# EAGLE design Ana-DigiColorMixerV1 (EAGLE 6.4)
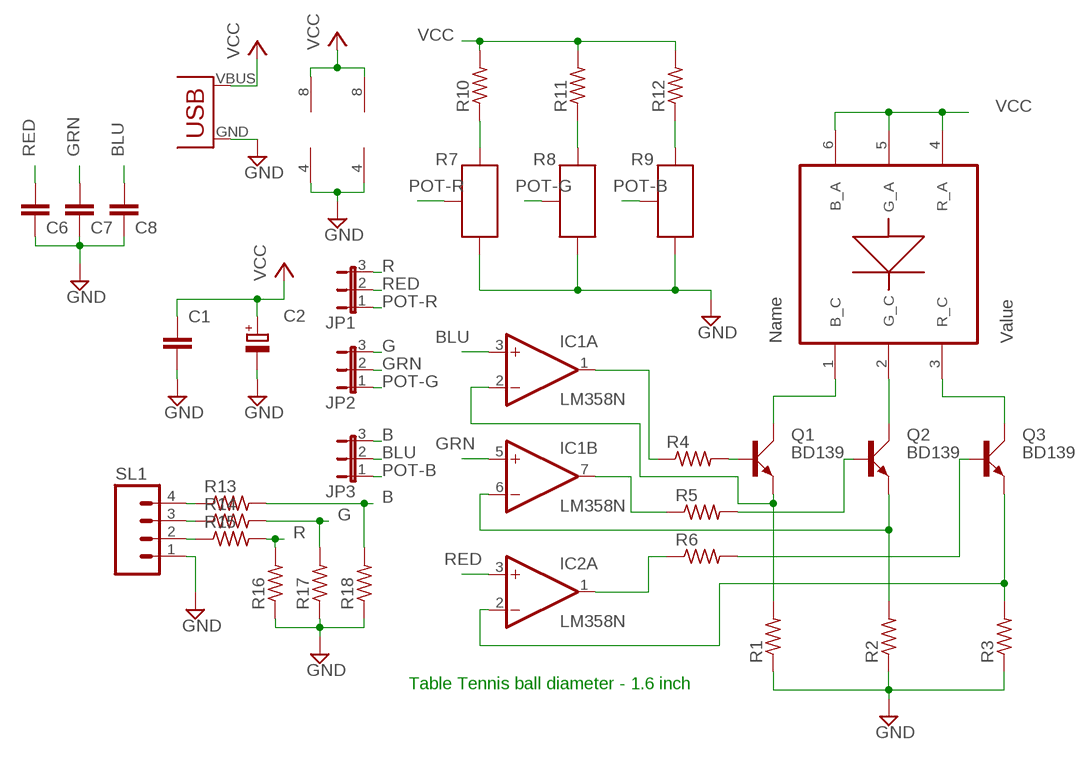
[diagram p0: schematic, sheet 1]

## Parts
C1  0.1uf  C-EU025-024X044  [C025-024X044]
C2  100uf  CPOL-EUE3.5-8  [E3,5-8]
C6  0.1uf  C-EU025-024X044  [C025-024X044]
C7  0.1uf  C-EU025-024X044  [C025-024X044]
C8  0.1uf  C-EU025-024X044  [C025-024X044]
IC1  LM358N  [DIL08]
IC2  LM358N  [DIL08]
JP1  JP2E  [JP2]
JP2  JP2E  [JP2]
JP3  JP2E  [JP2]
Q1  BD139  [TO126AV]
Q2  BD139  [TO126AV]
Q3  BD139  [TO126AV]
R1  4.7  R-US_0411/15  [0411/15]
R2  R-US_0411/15  [0411/15]
R3  R-US_0411/15  [0411/15]
R4  R-US_0204/7  [0204/7]
R5  R-US_0204/7  [0204/7]
R6  R-US_0204/7  [0204/7]
R7  POTNORMAL  [RJ9W]
R8  POTNORMAL  [RJ9W]
R9  POTNORMAL  [RJ9W]
R10  R-US_0204/7  [0204/7]
R11  R-US_0204/7  [0204/7]
R12  R-US_0204/7  [0204/7]
R13  R-US_0204/7  [0204/7]
R14  R-US_0204/7  [0204/7]
R15  R-US_0204/7  [0204/7]
R16  R-US_0204/7  [0204/7]
R17  R-US_0204/7  [0204/7]
R18  R-US_0204/7  [0204/7]
SL1  M04  [04P]
U$1  RGB_SMD_3W  [RGB_SMD_6PIN]
U$2  USB(POWER)  [USB(POWER)]

## Nets
3V3: R9.E R12.1
B: JP3.3 R13.2 R18.2
BLU: C8.1 IC1.3(A:+IN) JP3.2
G: JP2.3 R14.2 R17.2
GND: C1.2 C2.- C6.2 C7.2 C8.2 IC1.4(P:V-) IC2.4(P:V-) R1.1 R2.1 R3.1 R7.A R8.A R9.A R16.1 R17.1 R18.1 SL1.1 U$2.GND
GRN: C7.1 IC1.5(B:+IN) JP2.2
N$1: Q1.C U$1.1(B_C)
N$3: Q2.C U$1.2(G_C)
N$4: Q3.C U$1.3(R_C)
N$5: Q1.B R4.2
N$6: Q2.B R5.2
N$10: Q3.B R6.2
N$12: IC1.6(B:-IN) Q2.E R2.2
N$13: R13.1 SL1.4
N$14: IC1.1(A:OUT) R4.1
N$15: IC1.7(B:OUT) R5.1
N$16: IC2.1(A:OUT) R6.1
N$17: R14.1 SL1.3
N$18: R15.1 SL1.2
N$20: R7.E R10.1
N$21: R8.E R11.1
N$22: IC1.2(A:-IN) Q1.E R1.2
N$24: IC2.2(A:-IN) Q3.E R3.2
POT-B: JP3.1 R9.S
POT-G: JP2.1 R8.S
POT-R: JP1.1 R7.S
R: JP1.3 R15.2 R16.2
RED: C6.1 IC2.3(A:+IN) JP1.2
VCC: C1.1 C2.+ IC1.8(P:V+) IC2.8(P:V+) R10.2 R11.2 R12.2 U$1.4(R_A) U$1.5(G_A) U$1.6(B_A) U$2.VBUS(VCC)
Unconnected: IC2.5(B:+IN) IC2.6(B:-IN) IC2.7(B:OUT)

## Notes on the sheet
- Table Tennis ball diameter - 1.6 inch

## Library data of the parts
C1 C6-C8 = rcl:C-EU: CAPACITOR, European symbol
C2 = rcl:CPOL-EU: POLARIZED CAPACITOR, European symbol
IC1 IC2 = CEDT_JANUARY_2015:LM358: OP AMP also LM158; LM258; LM2904 Source: http://cache.national.com/ds/LM/LM158.pdf
JP1-JP3 = jumper:JP2E: JUMPER
Q1-Q3 = transistor-power:BD139: NPN TRANSISTOR
R1-R6 R10-R18 = resistor:R-US_: RESISTOR, American symbol
R7-R9 = CEDTv78:POT
SL1 = con-amp-quick:M04: AMP QUICK CONNECTOR; OC_FARNELL: unknown; OC_NEWARK: unknown
U$1 = CEDTv78:RGB_SMD_3W: RGB SMD 3W(1W each)
U$2 = CEDT_JANUARY_2015_v5:USB(POWER)

## Net classes
0 default: width 0.61 mm
1 power: width 0.61 mm

## Board
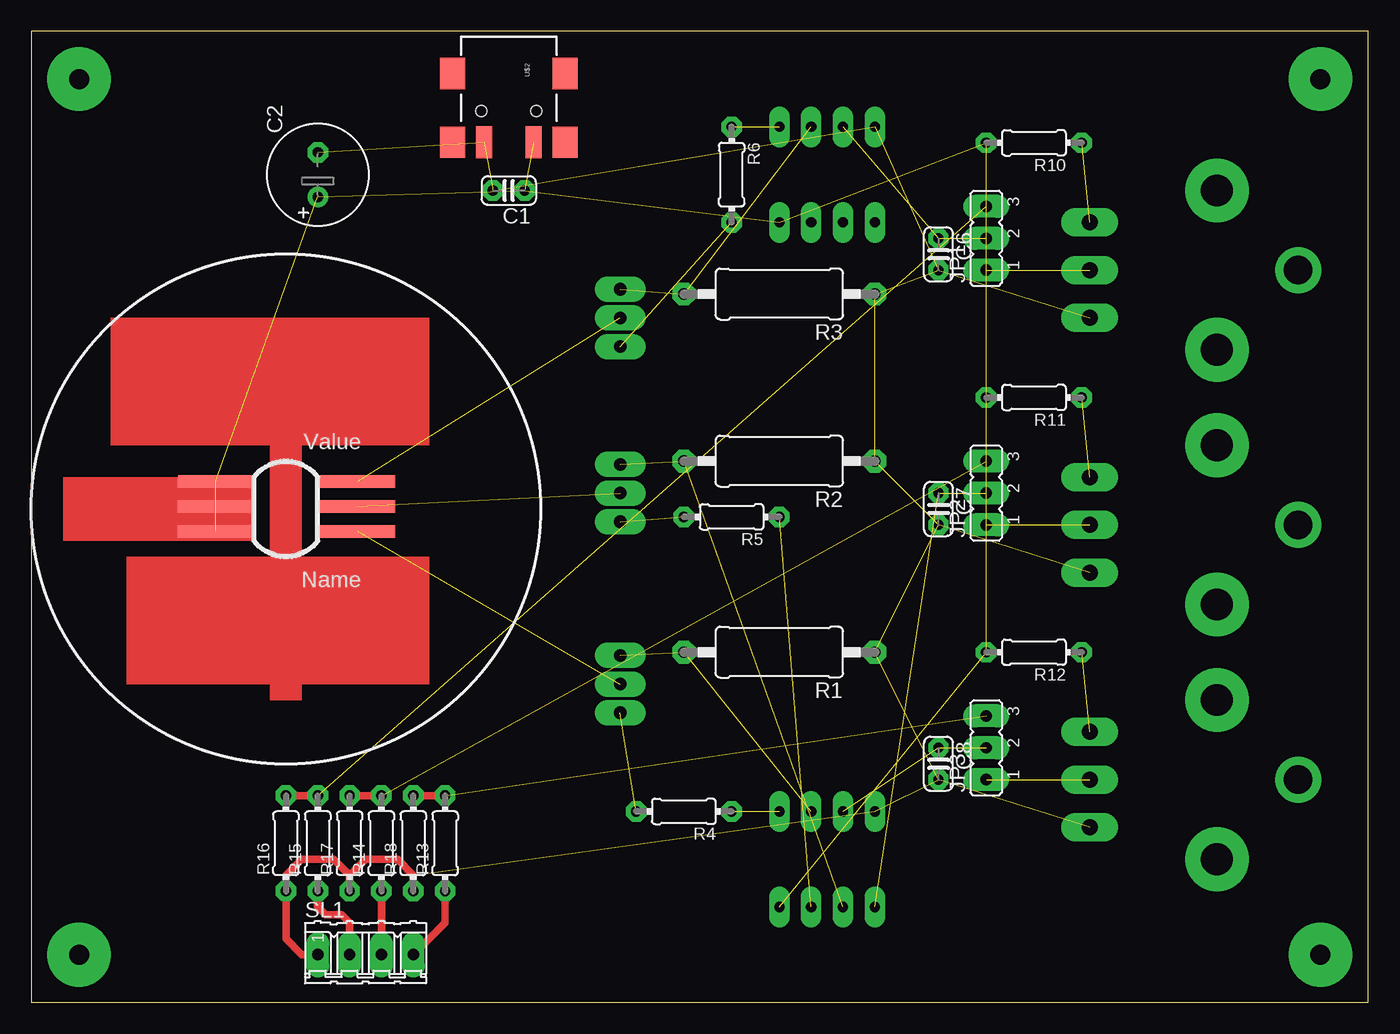
[diagram p1: board, top side]
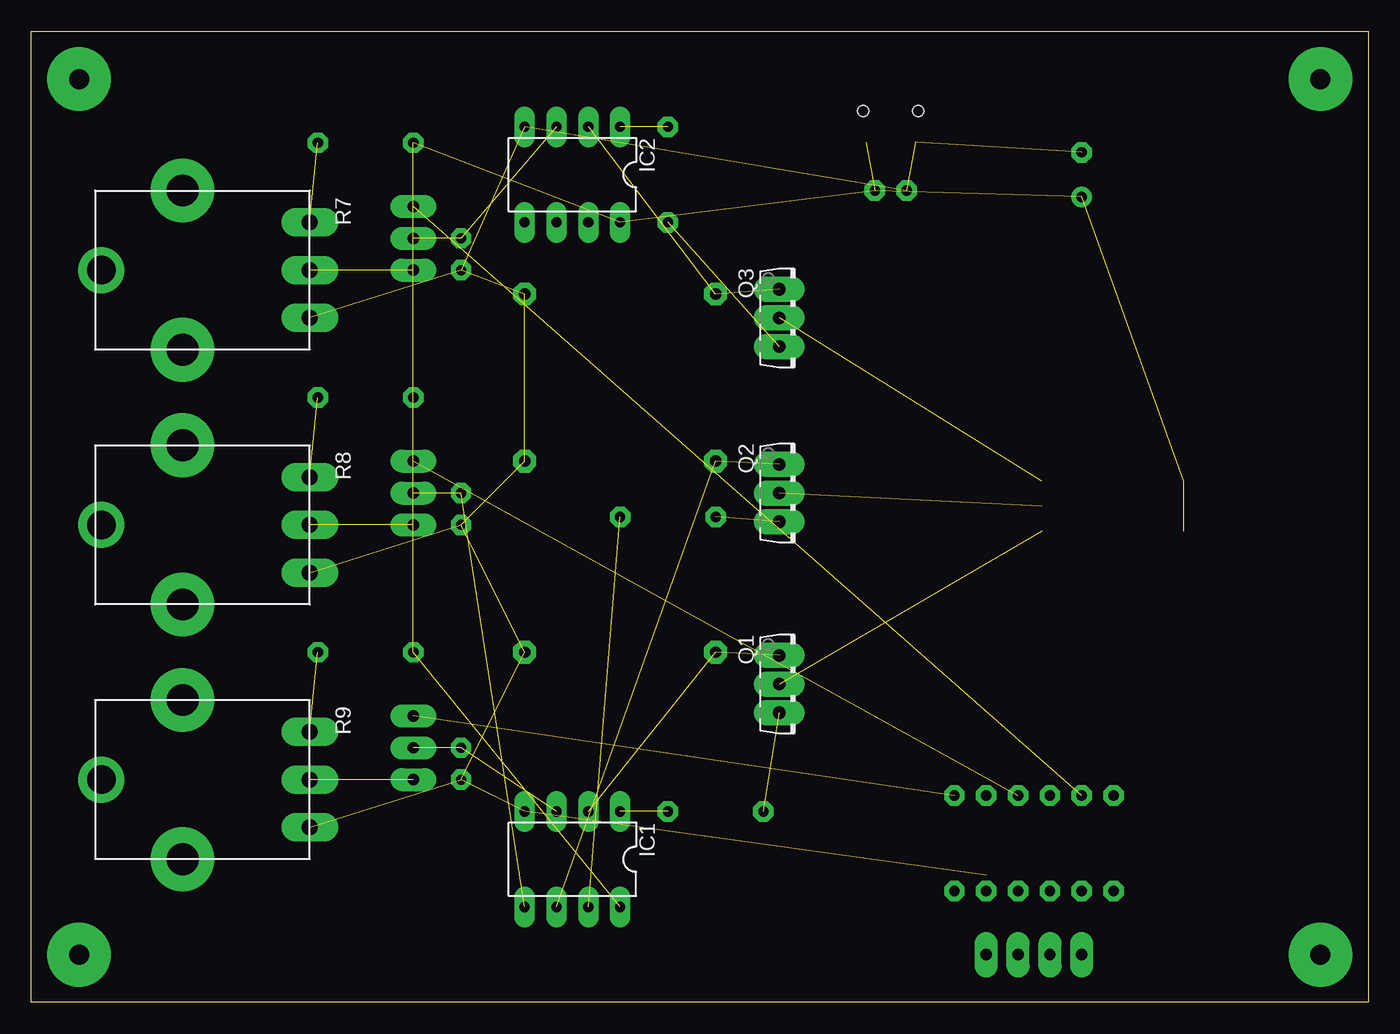
[diagram p2: board, bottom side, seen from below]

Size 106.68 x 77.47 mm. Coordinates in mm from the lower left corner, seen from the top.
Outline: 0,0 106.68,0 106.68,77.47 0,77.47 0,0
Copper layers (1*16): Top 0.035mm / dielectric 1.5mm / Bottom 0.035mm
Design rules "default *": minimum track width 24mil, minimum drill 24mil, track to track 12mil, track to pad 12mil, pad to pad 12mil, via to via 12mil, smd to smd 12mil, copper to edge 40mil, drill to drill 20mil, minimum pad ring 16mil, minimum via ring 16mil, stop-mask expansion 4mil, vias tented up to drill 0mil, thermal gap 10mil

### Footprints (pad centres in the part's own frame; a part is rotated, then mirrored left to right if it is on the bottom)
C025-024X044 = drill 0.813 octagon: 1 -1.27,0; 2 1.27,0
E3,5-8 = drill 0.813 pad 1.6: + -1.778,0 | drill 0.813 pad 1.6 octagon: - 1.778,0
DIL08 = drill 0.813 long: 1 -3.81,-3.81; 2 -1.27,-3.81; 3 1.27,-3.81; 4 3.81,-3.81; 5 3.81,3.81; 6 1.27,3.81; 7 -1.27,3.81; 8 -3.81,3.81
JP2 = drill 0.914 long: 1 -2.54,0; 2 0,0; 3 2.54,0
TO126AV = drill 1.016 long: B 2.286,-1.27; C 0,-1.27; E -2.286,-1.27
0411/15 = drill 0.914 octagon: 1 -7.62,0; 2 7.62,0
0204/7 = drill 0.813 octagon: 1 -3.81,0; 2 3.81,0
RJ9W = drill 1.27 long: A 3.81,8.255; E -3.81,8.255; S 0,8.255 | drill 2.286 pad 3.658: P$1 0,-8.382 | drill 2.54 pad 5.08: P$3 6.35,-1.905; P$4 -6.35,-1.905
04P = drill 0.914 long: 1 -3.81,0; 2 -1.27,0; 3 1.27,0; 4 3.81,0
RGB_SMD_6PIN = smd 6 x 0.998: 1 -5.728,1.795; 2 -5.728,-0.205; 3 -5.728,-2.205; 4 5.59,-2.205; 5 5.59,-0.205; 6 5.59,1.795
USB(POWER) = smd 2.54 x 1.27: GND 2.5,-1.981; VBUS 2.5,1.981 | smd 2.5 x 2: GND@1 -3,-4.5; GND@2 -3,4.5; GND@3 2.5,4.5; GND@4 2.5,-4.5 | hole 0.9: 0,2.2; 0,-2.2

### Placement (x,y rotation side)
C1  38.1,64.77 180 top
C2  22.86,66.04 90 top
C6  72.39,59.69 270 top
C7  72.39,39.37 270 top
C8  72.39,19.05 270 top
IC1  63.5,11.43 180 bottom
IC2  63.5,66.04 180 bottom
JP1  76.2,60.96 90 top
JP2  76.2,40.64 90 top
JP3  76.2,20.32 90 top
Q1  45.72,25.4 270 bottom
Q2  45.72,40.64 270 bottom
Q3  45.72,54.61 270 bottom
R1  59.69,27.94 180 top
R2  59.69,43.18 180 top
R3  59.69,56.52 180 top
R4  52.07,15.24 180 top
R5  55.88,38.73 180 top
R6  55.88,66.04 270 top
R7  92.71,58.42 270 bottom
R8  92.71,38.1 270 bottom
R9  92.71,17.78 270 bottom
R10  80.01,68.58 180 top
R11  80.01,48.26 180 top
R12  80.01,27.94 180 top
R13  33.02,12.7 90 top
R14  27.94,12.7 90 top
R15  22.86,12.7 90 top
R16  20.32,12.7 90 top
R17  25.4,12.7 90 top
R18  30.48,12.7 90 top
SL1  26.67,3.81 0 top
U$1  20.32,39.37 180 top
U$2  38.1,71.12 270 top

### Tracks (layer width: path | path; a pad name or v marks a point on that pad's centre or on a via)
3V3  (1 unrouted)
B  (1 unrouted)
  Top 0.61: R18.2 R13.2
BLU  (2 unrouted)
G  (1 unrouted)
  Top 0.61: R17.2 R14.2
GND  (14 unrouted)
  Top 0.61: 25.4,10.16 24.13,11.43 21.59,11.43 20.32,10.16 R16.1 20.32,5.08 21.59,3.81 SL1.1 | R17.1 25.4,10.16 | 25.4,10.16 26.67,11.43 29.21,11.43 30.48,10.16 R18.1
GRN  (2 unrouted)
N$1  (1 unrouted)
N$2  (via drill 1.6 pad 5.08)
  other vias: 3.81,73.66
N$3  (1 unrouted)
N$4  (1 unrouted)
N$5  (1 unrouted)
N$6  (1 unrouted)
N$7  (via drill 1.6 pad 5.08)
  other vias: 102.87,3.81
N$8  (via drill 1.6 pad 5.08)
  other vias: 3.81,3.81
N$9  (via drill 1.6 pad 5.08)
  other vias: 102.87,73.66
N$10  (1 unrouted)
N$12  (2 unrouted)
N$13
  Top 0.61: SL1.4 33.02,6.35 R13.1
N$14  (1 unrouted)
N$15  (1 unrouted)
N$16  (1 unrouted)
N$17
  Top 0.61: SL1.3 R14.1
N$18
  Top 0.61: SL1.2 25.4,6.35 24.77,6.99 23.5,6.99 22.86,7.62 R15.1
N$20  (1 unrouted)
N$21  (1 unrouted)
N$22  (2 unrouted)
N$24  (2 unrouted)
POT-B  (1 unrouted)
POT-G  (1 unrouted)
POT-R  (1 unrouted)
R  (1 unrouted)
  Top 0.61: R16.2 R15.2
RED  (2 unrouted)
VCC  (10 unrouted)
(copper drawn outside any net)
  shapes: Top area x4